# EAGLE design VIO module (EAGLE 5.07)
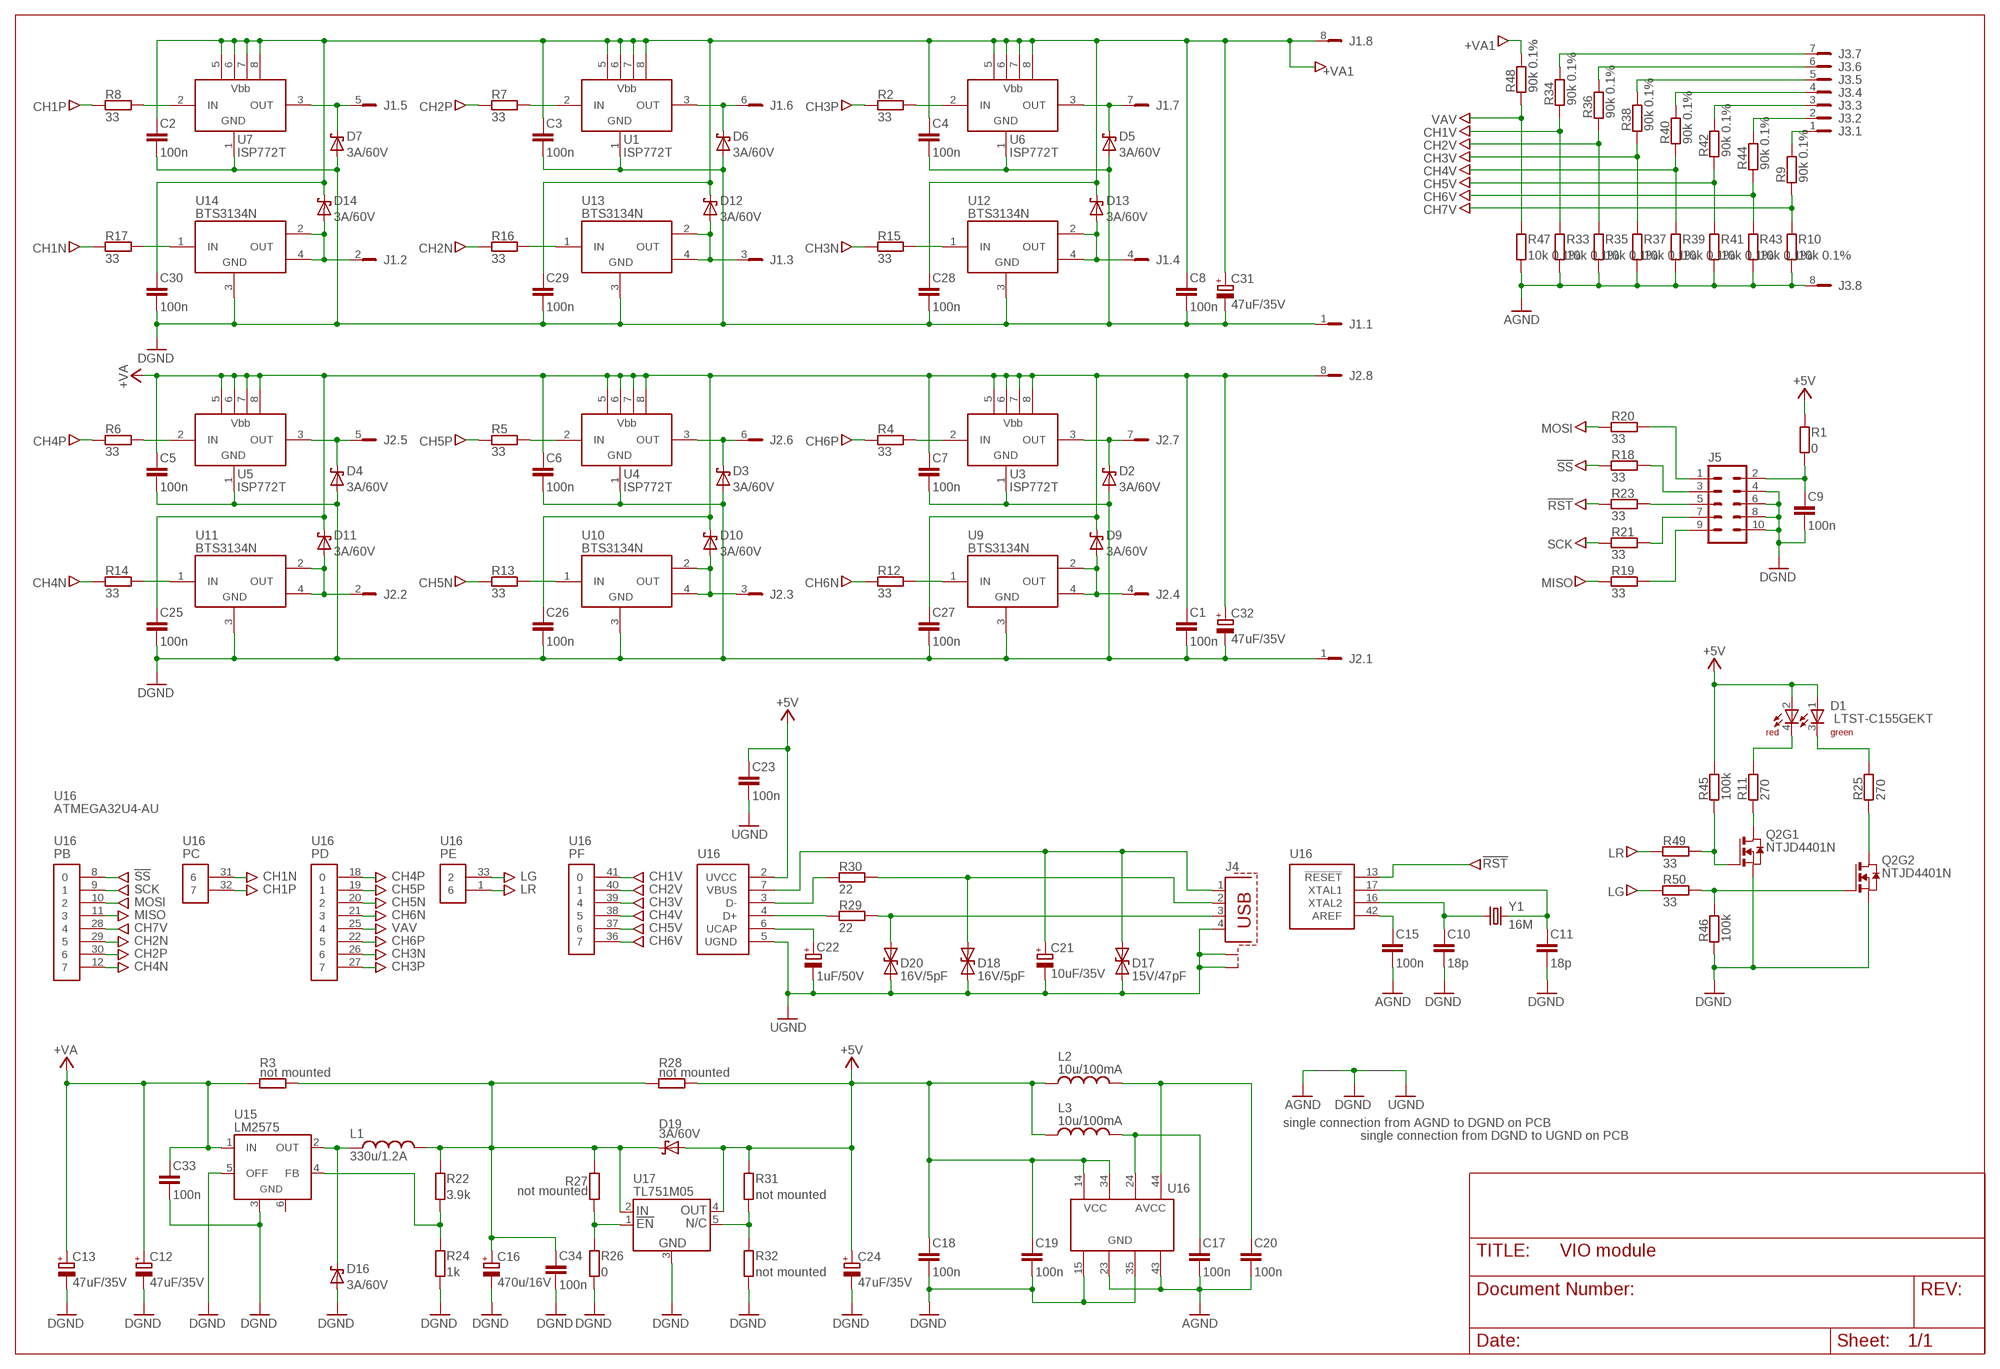
[diagram p0: schematic, sheet 1]

## Parts
C1  100n  C-X7R-0805  [C0805K]
C2  100n  C-X7R-0805  [C0805K]
C3  100n  C-X7R-0805  [C0805K]
C4  100n  C-X7R-0805  [C0805K]
C5  100n  C-X7R-0805  [C0805K]
C6  100n  C-X7R-0805  [C0805K]
C7  100n  C-X7R-0805  [C0805K]
C8  100n  C-X7R-0805  [C0805K]
C9  100n  C-X7R-0805  [C0805K]
C10  18p  C-C0G-0603  [C0603K]
C11  18p  C-C0G-0603  [C0603K]
C12  47uF/35V  CP-ALU-D  [PANASONIC_D]
C13  47uF/35V  CP-ALU-D  [PANASONIC_D]
C15  100n  C-X7R-0805  [C0805K]
C16  470u/16V  CP-ALU-F  [PANASONIC_F]
C17  100n  C-X7R-0805  [C0805K]
C18  100n  C-X7R-0805  [C0805K]
C19  100n  C-X7R-0805  [C0805K]
C20  100n  C-X7R-0805  [C0805K]
C21  10uF/35V  CP-ALU-B  [PANASONIC_B]
C22  1uF/50V  CP-ALU-B  [PANASONIC_B]
C23  100n  C-X7R-0805  [C0805K]
C24  47uF/35V  CP-ALU-D  [PANASONIC_D]
C25  100n  C-X7R-0805  [C0805K]
C26  100n  C-X7R-0805  [C0805K]
C27  100n  C-X7R-0805  [C0805K]
C28  100n  C-X7R-0805  [C0805K]
C29  100n  C-X7R-0805  [C0805K]
C30  100n  C-X7R-0805  [C0805K]
C31  47uF/35V  CP-ALU-D  [PANASONIC_D]
C32  47uF/35V  CP-ALU-D  [PANASONIC_D]
C33  100n  C-X7R-0805  [C0805K]
C34  100n  C-X7R-0805  [C0805K]
D1  LTST-C155GEKT  D-2LED4-320X270  [D-LITEON-LTST]
D2  3A/60V  DS-B360A-SMA  [SMA]
D3  3A/60V  DS-B360A-SMA  [SMA]
D4  3A/60V  DS-B360A-SMA  [SMA]
D5  3A/60V  DS-B360A-SMA  [SMA]
D6  3A/60V  DS-B360A-SMA  [SMA]
D7  3A/60V  DS-B360A-SMA  [SMA]
D9  3A/60V  DS-B360A-SMA  [SMA]
D10  3A/60V  DS-B360A-SMA  [SMA]
D11  3A/60V  DS-B360A-SMA  [SMA]
D12  3A/60V  DS-B360A-SMA  [SMA]
D13  3A/60V  DS-B360A-SMA  [SMA]
D14  3A/60V  DS-B360A-SMA  [SMA]
D16  3A/60V  DS-B360A-SMA  [SMA]
D17  15V/47pF  CDS2C15GTA  [EPCOS_CD_0402]
D18  16V/5pF  CDS2C16GTH  [EPCOS_CD_0402]
D19  3A/60V  DS-B360A-SMA  [SMA]
D20  16V/5pF  CDS2C16GTH  [EPCOS_CD_0402]
J1  J-M8-TB508V  J-M8-TB508HV  [J-M8-TB508HV]
J2  J-M8-TB508V  J-M8-TB508HV  [J-M8-TB508HV]
J3  J-M8-TB508V  J-M8-TB508HV  [J-M8-TB508HV]
J4  J-USB6-BV  [J-USB6-BV]
J5  J-M10-V  [J-M10-V]
L1  330u/1.2A  L-TOROIDAL-MURATA3300  [MURATA3300]
L2  10u/100mA  L-CHIP-1210  [R1210]
L3  10u/100mA  L-CHIP-1210  [R1210]
Q2  NTJD4401N  Q-2ND-SOT363  [SOT363]
R1  0  R-0603  [R0603]
R2  33  R-0603  [R0603]
R3  not mounted  R-0603  [R0603]
R4  33  R-0603  [R0603]
R5  33  R-0603  [R0603]
R6  33  R-0603  [R0603]
R7  33  R-0603  [R0603]
R8  33  R-0603  [R0603]
R9  90k 0.1%  R-0603  [R0603]
R10  10k 0.1%  R-0603  [R0603]
R11  270  R-0603  [R0603]
R12  33  R-0603  [R0603]
R13  33  R-0603  [R0603]
R14  33  R-0603  [R0603]
R15  33  R-0603  [R0603]
R16  33  R-0603  [R0603]
R17  33  R-0603  [R0603]
R18  33  R-0603  [R0603]
R19  33  R-0603  [R0603]
R20  33  R-0603  [R0603]
R21  33  R-0603  [R0603]
R22  3.9k  R-0603  [R0603]
R23  33  R-0603  [R0603]
R24  1k  R-0603  [R0603]
R25  270  R-0603  [R0603]
R26  0  R-0603  [R0603]
R27  not mounted  R-0603  [R0603]
R28  not mounted  R-0603  [R0603]
R29  22  R-0402  [0402]
R30  22  R-0402  [0402]
R31  not mounted  R-0603  [R0603]
R32  not mounted  R-0603  [R0603]
R33  10k 0.1%  R-0603  [R0603]
R34  90k 0.1%  R-0603  [R0603]
R35  10k 0.1%  R-0603  [R0603]
R36  90k 0.1%  R-0603  [R0603]
R37  10k 0.1%  R-0603  [R0603]
R38  90k 0.1%  R-0603  [R0603]
R39  10k 0.1%  R-0603  [R0603]
R40  90k 0.1%  R-0603  [R0603]
R41  10k 0.1%  R-0603  [R0603]
R42  90k 0.1%  R-0603  [R0603]
R43  10k 0.1%  R-0603  [R0603]
R44  90k 0.1%  R-0603  [R0603]
R45  100k  R-0603  [R0603]
R46  100k  R-0603  [R0603]
R47  10k 0.1%  R-0603  [R0603]
R48  90k 0.1%  R-0603  [R0603]
R49  33  R-0603  [R0603]
R50  33  R-0603  [R0603]
U1  ISP772T  [SO08]
U3  ISP772T  [SO08]
U4  ISP772T  [SO08]
U5  ISP772T  [SO08]
U6  ISP772T  [SO08]
U7  ISP772T  [SO08]
U9  BTS3134N  [SOT223-R]
U10  BTS3134N  [SOT223-R]
U11  BTS3134N  [SOT223-R]
U12  BTS3134N  [SOT223-R]
U13  BTS3134N  [SOT223-R]
U14  BTS3134N  [SOT223-R]
U15  LM2575  LM2575-TO263  [TO263-5]
U16  ATMEGA32U4-AU  [TQFP44]
U17  TL751M05  U-VPDN-TO263  [TO263-5]
Y1  16M  X-HC49UP  [HC49UP]

## Nets
!RST: R23.2 U16.13(SYS:!RESET)
!SS: R18.2 U16.8
+5V: C18.1 C19.1 C23.1 C24.+ D1.1(GA) D1.2(RA) D19.A L2.1 L3.1 R1.2 R28.1 R31.2 R45.1 U16.2(USB:UVCC) U16.14(PWR:VCC1) U16.34(PWR:VCC2) U17.4(OUT)
+5VA1: C20.1 L2.2 U16.44(PWR:AVCC2)
+VA: C1.1 C5.1 C6.1 C7.1 C12.+ C13.+ C25.1 C26.1 C27.1 C32.+ C33.1 D9.K(C) D10.K(C) D11.K(C) J2.8 R3.2 U3.5(VBB1) U3.6(VBB2) U3.7(VBB3) U3.8(VBB4) U4.5(VBB1) U4.6(VBB2) U4.7(VBB3) U4.8(VBB4) U5.5(VBB1) U5.6(VBB2) U5.7(VBB3) U5.8(VBB4) U15.1(IN)
+VA1: C2.1 C3.1 C4.1 C8.1 C28.1 C29.1 C30.1 C31.+ D12.K(C) D13.K(C) D14.K(C) J1.8 R48.1 U1.5(VBB1) U1.6(VBB2) U1.7(VBB3) U1.8(VBB4) U6.5(VBB1) U6.6(VBB2) U6.7(VBB3) U6.8(VBB4) U7.5(VBB1) U7.6(VBB2) U7.7(VBB3) U7.8(VBB4)
AGND: C15.2 C17.2 C20.2 J3.8 R10.1 R33.1 R35.1 R37.1 R39.1 R41.1 R43.1 R47.1 U16.23(PWR:GND2) U16.43(PWR:GND4)
CH1N: R17.2 U16.31
CH1P: R8.2 U16.32
CH1V: R33.2 R34.2 U16.41
CH2N: R16.2 U16.29
CH2P: R7.2 U16.30
CH2V: R35.2 R36.2 U16.40
CH3N: R15.2 U16.26
CH3P: R2.2 U16.27
CH3V: R37.2 R38.2 U16.39
CH4N: R14.2 U16.12
CH4P: R6.2 U16.18
CH4V: R39.2 R40.2 U16.38
CH5N: R13.2 U16.20
CH5P: R5.2 U16.19
CH5V: R41.2 R42.2 U16.37
CH6N: R12.2 U16.21
CH6P: R4.2 U16.22
CH6V: R43.2 R44.2 U16.36
CH7V: R9.2 R10.2 U16.28
DGND: C1.2 C2.2 C3.2 C4.2 C5.2 C6.2 C7.2 C8.2 C9.2 C10.2 C11.2 C12.- C13.- C16.- C18.2 C19.2 C24.- C25.2 C26.2 C27.2 C28.2 C29.2 C30.2 C31.- C32.- C33.2 C34.2 D2.A D3.A D4.A D5.A D6.A D7.A D16.A J1.1 J2.1 J5.4 J5.6 J5.8 J5.10 Q2.1(S) Q2.4(S) R24.1 R26.1 R32.1 R46.2 U1.1(GND) U3.1(GND) U4.1(GND) U5.1(GND) U6.1(GND) U7.1(GND) U9.3(GND) U10.3(GND) U11.3(GND) U12.3(GND) U13.3(GND) U14.3(GND) U15.3(GND) U15.5(OFF) U16.15(PWR:GND1) U16.35(PWR:GND3) U17.3(GND)
IO1N: D14.A J1.2 U14.2(OUT) U14.4(OUT)
IO1P: D7.K(C) J1.5 U7.3(OUT)
IO2N: D12.A J1.3 U13.2(OUT) U13.4(OUT)
IO2P: D6.K(C) J1.6 U1.3(OUT)
IO3N: D13.A J1.4 U12.2(OUT) U12.4(OUT)
IO3P: D5.K(C) J1.7 U6.3(OUT)
IO4N: D11.A J2.2 U11.2(OUT) U11.4(OUT)
IO4P: D4.K(C) J2.5 U5.3(OUT)
IO5N: D10.A J2.3 U10.2(OUT) U10.4(OUT)
IO5P: D3.K(C) J2.6 U4.3(OUT)
IO5V: J3.3 R42.1
IO6N: D9.A J2.4 U9.2(OUT) U9.4(OUT)
IO6P: D2.K(C) J2.7 U3.3(OUT)
IO6V: J3.2 R44.1
LG: R50.2 U16.33
LR: R49.2 U16.1
MISO: R19.2 U16.11
MOSI: R20.2 U16.10
N$1: C22.+ U16.6(USB:UCAP)
N$2: C10.1 U16.16(SYS:XTAL2) Y1.1
N$3: R7.1 U1.2(IN)
N$4: R16.1 U13.1(IN)
N$5: R17.1 U14.1(IN)
N$6: R8.1 U7.2(IN)
N$7: R29.1 U16.4(USB:D+)
N$8: C21.+ D17.2 J4.1 U16.7(USB:VBUS)
N$9: C16.+ C34.1 D19.K(C) L1.3 R3.1 R22.2 R27.2 R28.2 U17.2(IN)
N$10: D20.2 J4.3 R29.2
N$11: R30.1 U16.3(USB:D-)
N$12: C15.1 U16.42(SYS:AREF)
N$13: D18.2 J4.2 R30.2
N$14: C11.1 U16.17(SYS:XTAL1) Y1.2
N$15: J5.3 R18.1
N$16: J5.9 R19.1
N$17: J5.5 R23.1
N$18: R22.1 R24.2 U15.4(FB)
N$19: J5.7 R21.1
N$20: J5.1 R20.1
N$21: C9.1 J5.2 R1.1
N$22: D16.K(C) L1.1 U15.2(OUT)
N$23: R31.1 R32.2 U17.5(N/C)
N$24: R26.2 R27.1 U17.1(!EN)
N$25: R2.1 U6.2(IN)
N$26: R15.1 U12.1(IN)
N$27: R6.1 U5.2(IN)
N$28: R14.1 U11.1(IN)
N$29: R5.1 U4.2(IN)
N$30: R13.1 U10.1(IN)
N$31: R4.1 U3.2(IN)
N$32: R12.1 U9.1(IN)
N$33: C17.1 L3.2 U16.24(PWR:AVCC1)
N$34: J3.1 R9.1
N$37: D1.3(GC) R25.1
N$38: Q2.6(D) R11.2
N$39: Q2.3(D) R25.2
N$40: D1.4(RC) R11.1
N$41: Q2.2(G) R45.2 R49.1
N$43: Q2.5(G) R46.1 R50.1
N$47: J3.4 R40.1
N$48: J3.5 R38.1
N$49: J3.6 R36.1
N$50: J3.7 R34.1
SCK: R21.2 U16.9
UGND: C21.- C22.- C23.2 D17.1 D18.1 D20.1 J4.4 J4.S1 J4.S2 U16.5(USB:UGND) ; supply symbol labelled SGNDU
VAV: R47.2 R48.2 U16.25
Unconnected: U15.6(GND)

## Notes on the sheet
- single connection from AGND to DGND on PCB
- single connection from DGND to UGND on PCB

## Library data of the parts
C1-C11 C15 C17-C20 C23 C25-C30 C33 C34 = VIO_module:C-*-?: CAPACITOR, European symbol
C12 C13 C16 C21 C22 C24 C31 C32 = VIO_module:CP-*-?: Aluminium electrolytic capacitor
D1 = VIO_module:D-2LED4-?: Duo LED, 4 poles, red and green
D2-D7 D9-D14 D16 D19 = VIO_module:DS-*-?: schottky diode
D17 D18 D20 = VIO_module:CD: bidirectional zener diode Standard series Device VDC,max V Ctyp pF CDS2C15GTA 15 47 High speed series Device VDC,max V Ctyp pF CDS2C16GTH 16 5
J1-J3 = VIO_module:J-M8-?: Jack connector, male, 8 poles
J4 = VIO_module:J-USB6-?: USB connector
J5 = VIO_module:J-M10-?: HARTING
L1-L3 = VIO_module:L-*-?: Inductor
Q2 = VIO_module:Q-2ND-?: MOS FET
R1-R50 = VIO_module:R-?: Resistor
U1 U3-U7 = VIO_module:ISP*?: Smart power high-side-switch for industrial applications
U9-U14 = VIO_module:BTS*?: Smart low side power switch
U15 = VIO_module:LM25*-?: STEP-DOWN VOLTAGE REGULATOR
U16 = VIO_module:ATMEGA*U4?
U17 = VIO_module:U-VPDN-?: Linear fixed voltage regulator with enable
Y1 = VIO_module:X-?: CRYSTAL

## Board
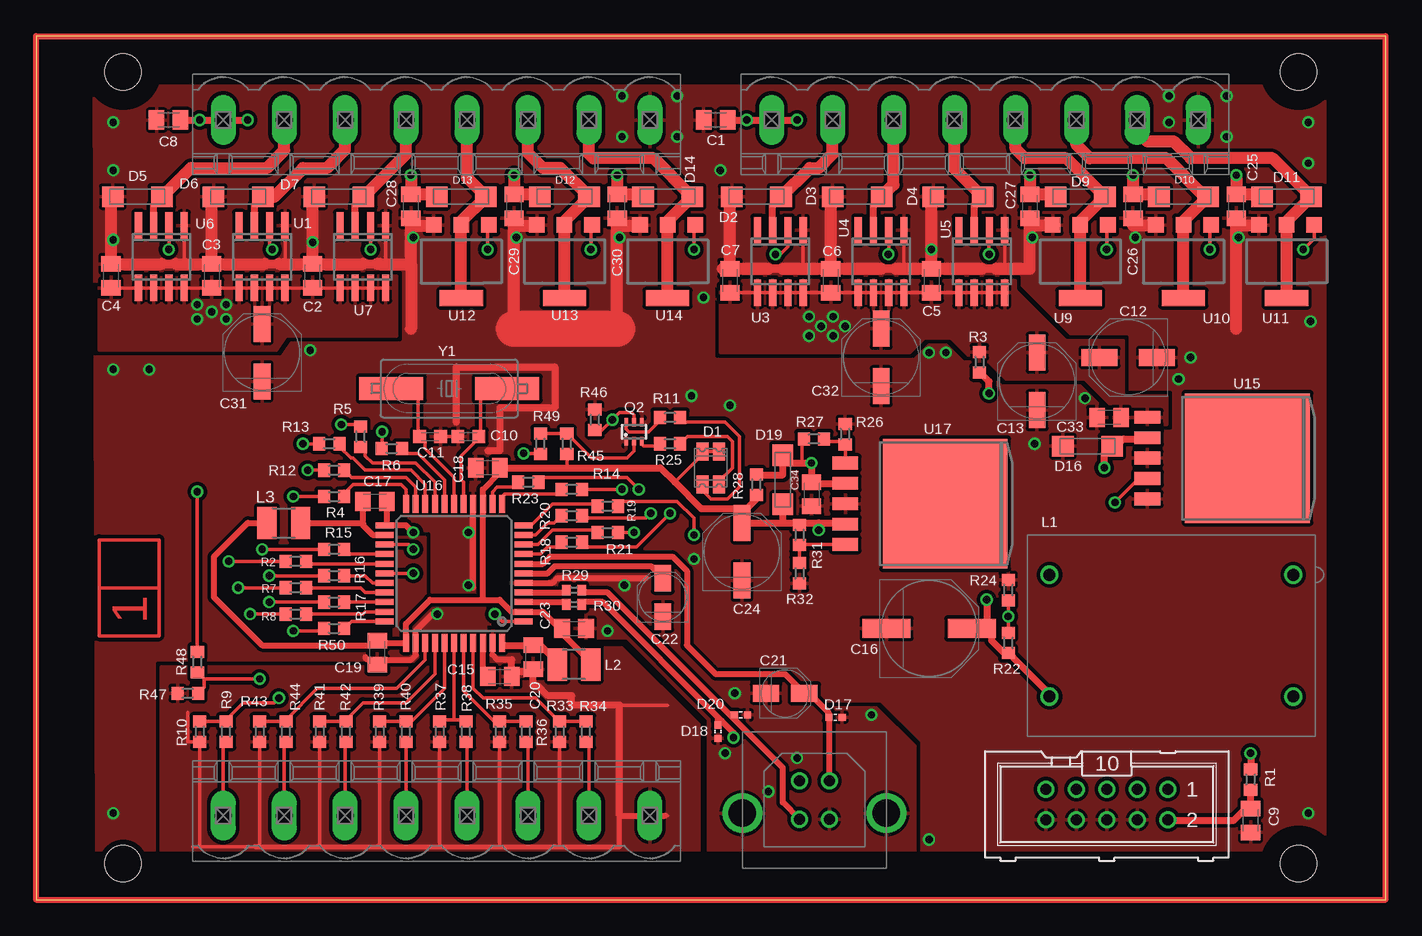
[diagram p1: board, top side]
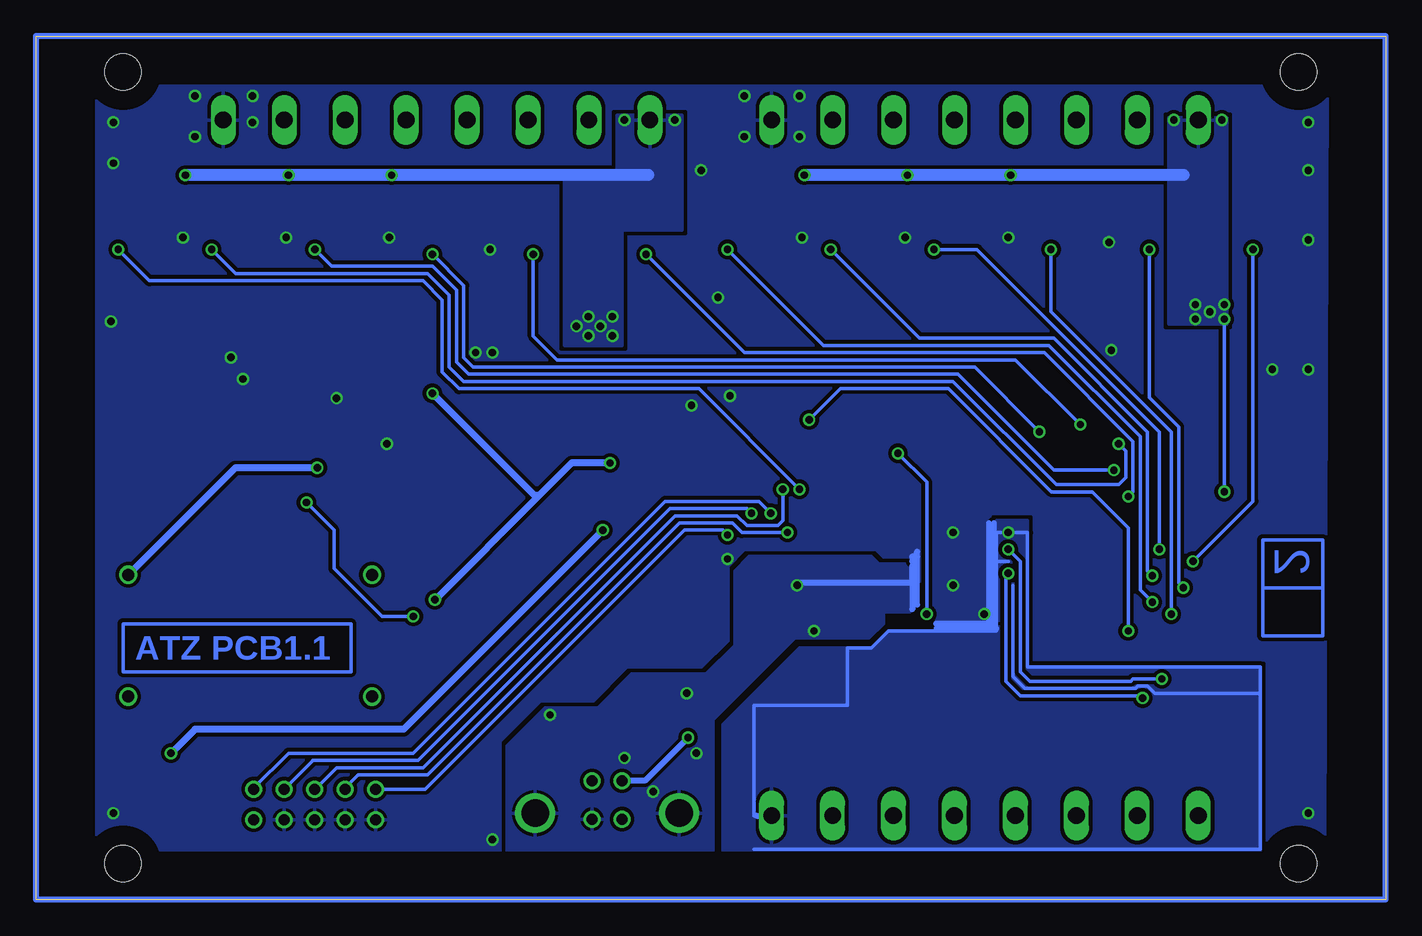
[diagram p2: board, bottom side, seen from below]

Size 112.5 x 72 mm. Coordinates in mm from the lower left corner, seen from the top.
Outline: 0,0 112.5,0 112.5,72 0,72 0,0
Copper layers (1*16): Top 0.035mm / dielectric 1.5mm / Bottom 0.035mm
Design rules "VIO module *": minimum track width 8mil, minimum drill 0.6mm, track to track 0.3mm, track to pad 0.3mm, pad to pad 0.3mm, via to via 0.3mm, smd to smd 0.3mm, copper to edge 0.5mm, drill to drill 8mil, minimum pad ring 10mil, minimum via ring 8mil, stop-mask expansion 0mil, vias tented up to drill 0mil, thermal gap 10mil
Holes 3 mm at 7.25,69 105.25,69 105.25,3 7.25,3
tRestrict: area 4.2,68 to 108.2,71.5; area 4.2,0.5 to 108.2,4; area 4.2,66 to 10.2,72; area 102.2,66 to 108.2,72; area 102.2,0 to 108.2,6
bRestrict: area 4.2,68 to 108.2,71.5; area 4.2,0.5 to 108.2,4; area 4.2,66 to 10.2,72; area 102.2,66 to 108.2,72; area 102.2,0 to 108.2,6; area 4.2,0 to 10.2,6

### Footprints (pad centres in the part's own frame; a part is rotated, then mirrored left to right if it is on the bottom)
C0805K = smd 1.3 x 1.6: 1 -1,0; 2 1,0
C0603K = smd 1.05 x 1.08: 1 -0.875,0; 2 0.875,0
PANASONIC_D = smd 3 x 1.4: + 2.4,0; - -2.4,0
PANASONIC_F = smd 4 x 1.6: + 3.55,0; - -3.55,0
PANASONIC_B = smd 2.2 x 1.4: + 1.6,0; - -1.6,0
D-LITEON-LTST = smd 1 x 1.5: 1 0.7,1.375; 2 -0.7,1.375; 3 0.7,-1.375; 4 -0.7,-1.375
SMA = smd 1.8 x 1.7: A -2.05,0; K 2.05,0
EPCOS_CD_0402 = smd 0.6 x 0.6: 1 -0.55,0; 2 0.55,0
J-M8-TB508HV = drill 1.4 long: 1 0,0; 2 5.08,0; 3 10.16,0; 4 15.24,0; 5 20.32,0; 6 25.4,0; 7 30.48,0; 8 35.56,0
J-USB6-BV = drill 0.92 round: 1 1.25,1.6; 2 -1.25,1.6; 3 -1.25,-1.6; 4 1.25,-1.6 | drill 2.3 round: S1 6,-1.1; S2 -6,-1.1
J-M10-V = drill 0.91 round: 1 0,0; 2 0,2.54; 3 2.54,0; 4 2.54,2.54; 5 5.08,0; 6 5.08,2.54; 7 7.62,0; 8 7.62,2.54; 9 10.16,0; 10 10.16,2.54
MURATA3300 = drill 1 round: 1 -10.16,-5.08; 2 10.16,-5.08; 3 10.16,5.08; 4 -10.16,5.08
R1210 = smd 1.6 x 2.7: 1 -1.4,0; 2 1.4,0
SOT363 = smd 0.3 x 0.7: 1 -0.65,-0.8; 2 0,-0.8; 3 0.65,-0.8; 4 0.65,0.8; 5 0,0.8; 6 -0.65,0.8
R0603 = smd 1 x 1.1: 1 -0.85,0; 2 0.85,0
0402 = smd 0.7 x 0.9: 1 -0.65,0; 2 0.65,0
SO08 = smd 0.6 x 2.2: 1 -1.905,-2.6; 2 -0.635,-2.6; 3 0.635,-2.6; 4 1.905,-2.6; 5 1.905,2.6; 6 0.635,2.6; 7 -0.635,2.6; 8 -1.905,2.6
SOT223-R = smd 1.3 x 1.3: 1 -2.3,-3.05; 2 0,-3.05; 3 2.3,-3.05 | smd 3.6 x 1.3: 4 0,3.05
TO263-5 = smd 1.067 x 2.159: 1 -3.404,-5.791; 2 -1.702,-5.791; 3 0,-5.791; 4 1.702,-5.791; 5 3.404,-5.791 | smd 10.8 x 10.41: 6 0,2.54
TQFP44 = smd 1.5 x 0.5: 1 -5.8,4; 2 -5.8,3.2; 3 -5.8,2.4; 4 -5.8,1.6; 5 -5.8,0.8; 6 -5.8,0; 7 -5.8,-0.8; 8 -5.8,-1.6; 9 -5.8,-2.4; 10 -5.8,-3.2; 11 -5.8,-4; 23 5.8,-4; 24 5.8,-3.2; 25 5.8,-2.4; 26 5.8,-1.6; 27 5.8,-0.8; 28 5.8,0; 29 5.8,0.8; 30 5.8,1.6; 31 5.8,2.4; 32 5.8,3.2; 33 5.8,4 | smd 0.5 x 1.5: 12 -4,-5.8; 13 -3.2,-5.8; 14 -2.4,-5.8; 15 -1.6,-5.8; 16 -0.8,-5.8; 17 0,-5.8; 18 0.8,-5.8; 19 1.6,-5.8; 20 2.4,-5.8; 21 3.2,-5.8; 22 4,-5.8; 34 4,5.8; 35 3.2,5.8; 36 2.4,5.8; 37 1.6,5.8; 38 0.8,5.8; 39 0,5.8; 40 -0.8,5.8; 41 -1.6,5.8; 42 -2.4,5.8; 43 -3.2,5.8; 44 -4,5.8
HC49UP = smd 5.334 x 1.93: 1 -4.826,0; 2 4.826,0

### Placement (x,y rotation side)
C1  56.65,65 180 top
C2  23.05,52 90 top
C3  14.65,52 90 top
C4  6.25,52 90 top
C5  74.65,51.6 90 top
C6  66.25,51.6 90 top
C7  57.85,51.6 90 top
C8  11.05,65 180 top
C9  101.25,6.6 270 top
C10  36.05,38.6 180 top
C11  32.85,38.6 0 top
C12  91.05,45.2 180 top
C13  83.45,43.2 90 top
C15  38.65,18.6 0 top
C16  74.45,22.6 0 top
C17  28.25,33.2 0 top
C18  37.65,36 180 top
C19  28.45,20.6 270 top
C20  41.45,20.2 270 top
C21  62.45,17.2 0 top
C22  52.25,25.2 90 top
C23  44.85,22.6 0 top
C24  58.85,29 90 top
C25  100.05,57.8 270 top
C26  91.45,57.8 270 top
C27  82.85,57.8 270 top
C28  31.25,57.8 270 top
C29  39.85,57.8 270 top
C30  48.45,57.8 270 top
C31  18.85,45.6 90 top
C32  70.45,45.2 90 top
C33  89.45,40.2 180 top
C34  64.65,33.8 270 top
D1  56.25,36 0 top
D2  60.05,58.6 0 top
D3  68.45,58.6 0 top
D4  76.85,58.6 0 top
D5  8.45,58.6 0 top
D6  16.85,58.6 0 top
D7  25.25,58.6 0 top
D9  87.05,58.6 180 top
D10  95.65,58.6 180 top
D11  104.25,58.6 180 top
D12  44.05,58.6 180 top
D13  35.45,58.6 180 top
D14  52.65,58.6 180 top
D16  87.65,37.8 0 top
D17  66.65,15.2 180 top
D18  56.85,14 90 top
D19  62.25,35 90 top
D20  58.75,15.4 180 top
J1  51.17,65 180 top
J2  96.89,65 180 top
J3  15.61,7 0 top
J4  64.89,8.3 0 top
J5  94.35,9.2 180 top
L1  94.65,22 180 top
L2  44.85,19.6 180 top
L3  20.65,31.4 0 top
Q2  49.85,39 0 top
R1  101.25,10 90 top
R2  21.65,28.2 0 top
R3  78.65,44.8 90 top
R4  24.85,33.6 0 top
R5  27.05,38.6 270 top
R6  29.65,37.6 0 top
R7  21.65,26 0 top
R8  21.65,23.8 0 top
R9  15.85,14 90 top
R10  13.65,14 90 top
R11  52.85,40.2 180 top
R12  24.85,35.8 0 top
R13  24.45,38 0 top
R14  44.65,34.2 180 top
R15  24.85,29.2 0 top
R16  24.85,27 0 top
R17  24.85,24.8 0 top
R18  44.65,29.8 180 top
R19  47.65,32.8 180 top
R20  44.65,32 180 top
R21  47.65,30.6 180 top
R22  81.05,21.4 270 top
R23  41.05,34.8 180 top
R24  81.05,25.8 270 top
R25  52.85,38 180 top
R26  67.45,38.8 270 top
R27  64.85,38.4 180 top
R28  60.05,34.6 90 top
R29  44.85,25.8 0 top
R30  44.85,24.6 0 top
R31  63.65,30.4 90 top
R32  63.65,27.2 90 top
R33  43.65,14 90 top
R34  45.85,14 90 top
R35  38.65,14 90 top
R36  40.85,14 90 top
R37  33.65,14 90 top
R38  35.85,14 90 top
R39  28.65,14 90 top
R40  30.85,14 90 top
R41  23.65,14 90 top
R42  25.85,14 90 top
R43  18.65,14 90 top
R44  20.85,14 90 top
R45  44.25,38 90 top
R46  46.59,40 90 top
R47  12.65,17.2 0 top
R48  13.45,19.8 270 top
R49  42.05,38 270 top
R50  24.85,22.6 0 top
U1  18.85,53.6 180 top
U3  62.05,53.2 180 top
U4  70.45,53.2 180 top
U5  78.85,53.2 180 top
U6  10.45,53.6 180 top
U7  27.25,53.6 180 top
U9  87.05,53.2 180 top
U10  95.65,53.2 180 top
U11  104.25,53.2 180 top
U12  35.45,53.2 180 top
U13  44.05,53.2 180 top
U14  52.65,53.2 180 top
U15  98.45,36.8 270 top
U16  34.85,27.2 180 top
U17  73.25,33 270 top
Y1  34.45,42.6 180 top

### Tracks (layer width: path | path; a pad name or v marks a point on that pad's centre or on a via)
!RST
  Top 0.3: U16.13 38.05,34 38.45,34.4 39.8,34.4 R23.2
!SS
  Top 0.3: U16.8 42.05,28.8 42.65,29.4 43.4,29.4 R18.2
+5V  (via drill 0.6)
  Top 0.3: 57.05,37.48 D1.1 D1.2 55.25,37.08 55.25,36.8 53.25,34.8 | 44.25,36 R45.1 | R31.2 63.8,31.4 64.05,31.4 | 28.85,21.4 28.65,21.6 C19.1
  Top 0.5: 28.65,21.4 28.85,21.4 | C19.1 28.65,21.4 | C18.1 38.65,35.6 37.25,34.2 U16.14 37.25,25 | 37.25,25 32.85,25 30.85,23 U16.34 29.05,21.4 28.85,21.6 C19.1 | 37.25,25 38.65,25 39.65,24 U16.2 42.25,24 43.65,22.6 C23.1 44.05,22.4 44.05,22 45.85,20.2 46.25,20.2 L2.1 | 28.65,21.4 28.45,21.2 | L3.1 17.65,31.4 14.85,28.6 14.85,25.2 18.85,21.2 27.85,21.2 28.25,21.6 C19.1
  Top 0.6: L2.1 46.25,19.8 | C18.1 44.25,36 52.05,36 53.25,34.8 55.45,32.6 58.45,32.6 58.85,32.2 | 58.85,32.2 C24.+ 62.25,31.4 | v101.25,12.2 R1.2 | U17.4 67.36,31.4 65.25,31.4 | 62.25,31.4 64.05,31.4 65.25,31.4 | 58.85,32.2 60.05,33.4 R28.1 | 62.25,31.4 D19.A | 65.25,31.4 v65.25,30.8
  Bottom 0.6: v101.25,12.2 99.25,14.2 81.85,14.2 v65.25,30.8
+5VA1
  Top 0.5: 39.05,21.2 U16.44
  Top 0.6: L2.2 43.45,19.8 42.05,21.2 C20.1 39.05,21.2
+VA  (via drill 0.6)
  Top 0.3: U5.8 U5.7 U5.6 U5.5 75.25,50.6 75.25,51 | C5.1 U4.8 U4.7 U4.6 U4.5 66.85,50.6 66.85,51 | C6.1 U3.8 U3.7 U3.6 U3.5 58.45,50.6 58.45,51
  Top 0.6: C1.1 v59.25,65 v63.45,65
  Top 1: D9.K 84.8,58.8 C27.1 v82.85,60.4 | D10.K 93.4,58.8 C26.1 v91.45,60.4 | D11.K 102,58.8 C25.1 v100.05,60.4
  Bottom 1: 61.45,60.4 v82.85,60.4 v91.45,60.4 v100.05,60.4
  other vias: 64.45,48.6 64.45,47 65.45,47.8 66.45,47 66.45,48.6 67.45,47.8
  pour Top: 57.05,51.6 81.65,51.6 81.65,50.8 85.85,46.6 90.65,46.6 90.65,42 94.25,42 94.25,39.6 89.85,39.6 89.85,41 87.45,43.4 80.85,43.4 79.45,44.8 78.25,44.8 76.25,46.8 74.05,46.8 72.85,45.6 57.05,45.6
  pour Bottom: 58.65,65.4 64.05,65.4 64.05,60.6 68.45,60.6 68.45,46.2 63.65,46.2 63.65,55.8 58.65,55.8
+VA1  (via drill 0.6)
  Top 0.3: U7.8 U7.7 U7.6 U7.5 C2.1 U1.8 U1.7 U1.6 U1.5 C3.1 U6.8 U6.7 U6.6 U6.5 C4.1 | R48.1 v13.45,34
  Top 0.6: C8.1 v13.65,65 v17.65,65
  Top 1: D13.K 33.2,58.8 C28.1 v31.25,60.4 | D12.K 41.8,58.8 C29.1 v39.85,60.4 | D14.K 50.4,58.8 C30.1 v48.45,60.4
  Bottom 0.3: v13.45,34 v13.45,48.4
  Bottom 1: 16.85,60.4 v31.25,60.4 v39.85,60.4 v48.45,60.4
  other vias: 13.45,49.6 15.85,49.6 15.85,48.4 14.65,49
  pour Bottom: 13.25,65.2 18.05,65.2 18.05,48 13.25,48
  pour Top: 5.25,52 30.05,52 30.05,47 20.85,47 20.05,45.8 5.25,45.8
AGND  (via drill 0.6)
  Top 0.3: 13.65,4.4 18.25,4.4 | 44.65,16.2 44.85,16.2 | 48.65,16.2 52.65,16.2 | 33.65,4.4 R37.1 | 38.65,4.4 R35.1 | R33.1 43.65,4.4 43.25,4.4 | R39.1 28.65,4.4 28.45,4.4 | R41.1 23.65,4.4 23.45,4.4 | R43.1 18.65,4.4 18.45,4.4 | 13.65,4.4 R10.1 12.65,13.15 12.65,15.6 | 13.05,4.4 13.65,4.4 | 52.45,7 52.65,7
  Top 0.4: 18.25,4.4 18.45,4.4 23.45,4.4 28.45,4.4 33.65,4.4 38.65,4.4 43.25,4.4 48.65,4.4 48.65,7
  Top 0.5: 38.05,20.4 38.45,20 39.65,20 | C15.2 39.45,18.8 | 48.65,7 52.45,7 | 41.45,19 C20.2 | 29.25,31.2 U16.23 | 29.25,31.2 C17.2 29.25,33.4 | v31.45,30.6 30.85,31.2 29.25,31.2
  Top 0.6: 48.65,7 48.65,16.2 44.65,16.2 44.65,17 42.65,17 41.85,17.8 41.45,17.8 41.45,19 39.65,19 | 39.65,19 39.65,20 | 39.65,19 C15.2 | C20.2 41.05,19.2
  Bottom 0.3: 32.45,28.2 32.45,30.6 v31.45,30.6 29.85,30.6 29.85,19.4 10.45,19.4 10.45,17.2 | 32.45,28.2 32.45,22.6 32.45,22.4 41.45,22.4 42.85,21 44.85,21 44.85,16.2 52.65,16.2 52.65,7 52.45,7 | 10.45,17.2 19.25,17.2 19.85,17.8 20.65,17.8 20.85,17.6 30.05,17.6 31.05,18.6 31.05,26.2 | 10.45,17.2 10.45,4.2 52.65,4.2 | 32.45,28.2 31.45,28.2
  Bottom 0.45: 32.65,23 32.65,31.4 | 32.45,22.6 37.45,22.6
  Bottom 0.5: 52.45,7 J3.8 | 32.45,22.6 32.65,22.6 32.65,23
  pour Bottom: 10.45,19.4 29.85,19.4 29.85,31.6 32.45,31.6 32.45,22.4 41.45,22.4 42.85,21 48.85,21 55.25,14.6 55.25,0 10.45,0
  pour Top: 10.45,19.4 29.85,19.4 29.85,30.2 32.45,30.2 32.45,22.4 41.45,22.4 42.85,21 48.85,21 55.25,14.6 55.25,0 10.45,0
CH1N
  Top 0.3: R17.2 U16.31
CH1P
  Top 0.3: U16.32 27.45,24 27.25,23.8 R8.2
CH1V
  Top 0.3: R34.2 R33.2 43.6,14.85 41.65,16.8 37.25,16.8 36.45,17.6 U16.41
CH2N
  Top 0.3: U16.29 28.05,26.4 27.45,27 R16.2
CH2P
  Top 0.3: U16.30 27.45,25.6 27.05,26 22.65,26 R7.2 22.45,26
CH2V
  Top 0.3: R35.2 R36.2 | U16.40 35.65,17.4 38.2,14.85 R35.2 | 38.25,15 38.65,15 R35.2
CH3N
  Top 0.3: U16.26 26.1,28.8 R15.2
CH3P
  Top 0.3: U16.27 22.65,28 22.5,28.15 R2.2
CH3V
  Top 0.3: 33.6,14.85 R37.2 33.65,14.8 33.85,15 34.85,15 | 34.85,15 U16.39 | 34.85,15 35.45,15 35.6,14.85 R38.2
CH4N
  Top 0.3: U16.12 38.85,33.6 39.05,33.8 43.45,33.8 43.45,34.2 R14.2
CH4P
  Top 0.3: U16.18 34.05,35 31.85,37.2 30.9,37.2 R6.2
CH4V
  Top 0.3: R39.2 R40.2 31.3,14.85 34.05,17.6 U16.38
CH5N
  Top 0.3: U16.20 32.45,34.6 31.25,35.8 27.45,35.8 26.45,36.8 26.25,36.8 25.3,37.75 R13.2
CH5P
  Top 0.3: U16.19 33.25,34.8 31.65,36.4 28.05,36.4 27.45,37 27.45,37.35 R5.2
CH5V
  Top 0.3: R41.2 R42.2 25.85,15 27.25,16.4 30.85,16.4 33.25,18.8 U16.37
CH6N
  Top 0.3: U16.21 31.65,34.4 30.85,35.2 26.3,35.2 R12.2
CH6P
  Top 0.3: U16.22 30.85,34.2 30.45,34.6 26.45,34.6 25.7,33.85 R4.2 25.7,34.05
CH6V
  Top 0.3: R43.2 R44.2 20.85,15 23.45,17.6 30.05,17.6 32.45,20 U16.36
CH7V  (via drill 0.6)
  Top 0.3: R10.2 R9.2 | 16.05,15 16,15 R9.2 | R9.2 15.85,15 17.25,16.4 19.85,16.4 v20.25,16.8 | v31.45,27.2 U16.28
  Bottom 0.3: v20.25,16.8 20.45,17 30.45,17 31.65,18.2 31.65,27 v31.45,27.2
DGND  (via drill 0.6)
  Top 0.3: C11.2 C10.2 | 37.05,36.4 36.85,36.4 | 37.05,36.4 36.85,36.6 | 37.05,36.4 C18.2 36.45,35.8 36.45,35.4 | 29.16,53.1 U7.1 | U6.1 12.36,53.09 12.45,53 | U1.1 20.76,53.1 20.65,53 | U4.1 72.36,52.9 72.65,52.6 | 63.95,52.91 U3.1 | 63.65,52.6 63.95,52.91 | 63.95,52.91 65.94,52.91 C6.2 | U5.1 80.75,52.9 81.05,52.6
  Top 0.5: 28.45,20 27.65,20 27.45,20.2 | 28.45,20 31.25,20 31.65,20.4 U16.35 31.65,22.4 33.05,23.8 v33.45,23.8 | C19.2 28.45,20 | 36.45,26 U16.15
  Top 0.6: 37.65,37.4 38.65,37.4 38.65,41 43.25,41 43.25,44.4 35.05,44.4 35.05,39.8
  Top 0.7: 10.45,53 11.65,53 | 19.05,53 20.25,53 | 27.25,53 28.65,53 | 61.05,52.6 62.25,52.6 | 70.45,52.6 71.65,52.6 | 78.85,52.6 80.05,52.6
  Top 1: C5.2 74.65,58.45 D4.A | C6.2 66.25,58.45 D3.A | C7.2 57.85,58.45 D2.A | C2.2 23.05,58.45 D7.A | C3.2 14.65,58.45 D6.A | D5.A 6.25,58.45 C4.2 10.45,53 | 39.85,47.6 39.85,56.2 41.8,56.2 | 48.45,47.6 48.45,56.2 50.3,56.2 U14.3 | 41.8,56.2 41.85,56.2 | 41.8,56.2 U13.3 | 31.25,53 31.25,47.6 | 31.25,53 31.25,56.2 33.05,56.2 33.1,56.25 U12.3 | 11.65,53 12.45,53 C3.2 | 31.25,53 28.65,53 28.45,53 | C3.2 19.05,53 | 20.25,53 20.65,53 C2.2 | C2.2 27.25,53 | 57.25,52.6 61.05,52.6 | 62.25,52.6 63.65,52.6 C6.2 | C6.2 70.45,52.6 | 71.65,52.6 72.65,52.6 C5.2 | C5.2 78.85,52.6 | 80.05,52.6 81.05,52.6 82.85,52.6 82.85,56.2 82.9,56.25 U9.3 | 100.05,47.6 100.05,56.2 100.1,56.25 U11.3 | U10.3 91.5,56.25 91.45,56.2
  Top 3: 39.85,47.6 48.45,47.6
  Bottom 0.45: 33.05,23.4 33.05,31.4
  Bottom 0.5: 39.05,28.6 39.05,29 | 33.05,23 37.45,23 | 33.05,23 32.85,23 | 33.05,23 33.05,23.4 v33.45,23.8 | 39.05,24.6 39.05,28.6 | 39.05,28.6 39.45,28.6 39.45,28.2
  other vias: 9.45,44.2 6.45,44.2 23.05,54.8 6.45,55 6.45,60.8 22.85,45.8 57.05,60.8 6.45,64.8 55.65,50.2 31.45,55.2 48.85,67 48.85,63.6 53.45,67 53.45,63.6 94.45,67 99.25,67 94.45,64.8 99.25,63.6 106.05,64.8 106.05,61.4 100.25,55.2 106.25,48.2 91.65,55.2 87.45,41.8 95.25,43.4 96.25,45.2 83.25,38 74.45,45.6 75.85,45.6 74.65,54.2 83.05,55.2 40.05,55.2 48.65,55.2 6.45,7.2 106.05,7.2 74.45,5 54.65,42 57.85,41.2 36.05,30.6 36.05,26.2 54.85,28.4
  pour Top (rank 2): 5.05,4 107.45,4 107.45,69.2 4.85,69.2
  pour Bottom (rank 2): 5.05,4 107.45,4 107.45,69.2 4.85,69.2
IO1N
  Top 1: J1.2 46.09,62.16 46.45,61.8 51.5,61.8 D14.A 52.65,56.55 U14.2 U14.4
IO1P
  Top 0.6: U7.3 26.61,57.91 D7.K
  Top 1: J1.5 30.85,62.15 D7.K
IO2N
  Top 1: J1.3 41.01,62.24 42.25,61 43.7,61 D12.A 44.05,56.55 U13.2 U13.4
IO2P
  Top 0.6: U1.3 18.21,57.91 D6.K
  Top 1: J1.6 25.77,62.52 24.25,61 22.25,61 19.85,58.6 D6.K
IO3N
  Top 1: J1.4 35.93,60.17 D13.A 35.45,56.55 U12.2 U12.4
IO3P
  Top 0.6: U6.3 9.81,57.91 10.88,58.98
  Top 1: J1.7 20.69,62.44 19.25,61 12.9,61 10.88,58.98 D5.K
IO4N
  Top 1: U11.4 U11.2 104.25,56.55 D11.A 103.1,61.8 96.25,61.8 94.85,63.2 92.65,63.2 91.81,64.04 J2.2
IO4P
  Top 0.6: U5.3 78.22,57.91 D4.K
  Top 1: J2.5 76.57,60.93 D4.K
IO5N
  Top 1: J2.3 86.73,62.92 87.85,61.8 94.25,61.8 97.45,58.6 D10.A | D10.A 97.5,58.6 | D10.A 95.65,56.55 U10.2 U10.4
IO5P
  Top 0.6: U4.3 69.81,57.91 D3.K
  Top 1: J2.6 71.49,59.59 D3.K
IO5V
  Top 0.3: J3.3 25.77,13.07 R42.1
IO6N
  Top 1: J2.4 81.65,62.6 82.45,61.8 85.9,61.8 D9.A 87.05,56.55 U9.2 U9.4
IO6P
  Top 0.6: U3.3 61.41,57.91 D2.K
  Top 1: J2.7 66.41,62.16 65.25,61 64.5,61 D2.K
IO6V
  Top 0.3: J3.2 20.69,12.99 R44.1
LG
  Top 0.3: U16.33 26.3,23.2 R50.2
LR  (via drill 0.6)
  Top 0.3: v38.25,23.8 38.85,23.2 U16.1 | v40.65,37.2 42,37.2 R49.2
  Bottom 0.3: v38.25,23.8 38.25,34.8 v40.65,37.2
MISO
  Top 0.3: U16.11 41.25,31.2 43.05,33 46.6,33 R19.2
MOSI
  Top 0.3: U16.10 41.65,30.4 42.65,31.4 43.2,31.4 R20.2
N$1
  Top 0.5: U16.6 42.65,27.2 43.25,27.8 51.25,27.8 C22.+
N$2
  Top 0.3: U16.16 35.65,34.8 35.45,35 35.45,37 36.92,38.48 C10.1 | 40.45,42.6 Y1.1 37.05,42.6 37.05,38.73 C10.1 | C10.1 36.65,38.6
N$3  (via drill 0.6)
  Top 0.3: v16.85,26 R7.1 | U1.2 19.48,54.4 v19.69,54.2
  Bottom 0.3: v19.69,54.2 19.69,41.84 17.25,39.4 17.25,26.4 v16.85,26
N$4  (via drill 0.6)
  Top 0.3: v46.25,54.2 46.25,56.15 U13.1 | v19.45,27 R16.1
  Bottom 0.3: v46.25,54.2 38.85,46.8 27.65,46.8 19.85,39 19.85,27.4 v19.45,27
N$5  (via drill 0.6)
  Top 0.3: v19.45,24.8 R17.1 | v54.85,54.2 54.85,56.15 U14.1
  Bottom 0.3: v19.45,24.8 20.45,25.8 20.45,38.6 28.05,46.2 46.85,46.2 v54.85,54.2
N$6  (via drill 0.6)
  Top 0.3: v27.89,54.2 U7.2 | v17.85,23.8 R8.1
  Bottom 0.3: v27.89,54.2 27.89,49.03 17.85,39 v17.85,23.8
N$7
  Top 0.5: U16.4 44,25.6 R29.1
N$8
  Top 0.5: U16.7 42.25,28 42.85,28.6 53.05,28.6 54.25,27.4 54.25,21.2 56.65,18.8 62.45,18.8 C21.+ 64.45,16.8 64.85,16.8 66.1,15.55 D17.2 66.1,9.94 J4.1
N$9  (via drill 0.6)
  Top 0.3: R27.2 64,38.35 63.85,38.2 63.85,36.4 | R22.2 81.4,20.2 81.45,20.2
  Top 0.6: C34.1 64.75,34.7 U17.2 66.95,34.7 | R28.2 60.1,35.4 62.25,35.4 62.25,36.4 | C34.1 64.45,34.8 | 62.25,36.4 D19.K | v79.25,25 79.25,22.6 | C34.1 v64.65,36.4 63.85,36.4 62.25,36.4 | 79.25,22.6 C16.+ | 81.45,20.2 84.49,17.16 L1.3 | 79.25,22.6 79.65,22.2 79.65,21.6 80.7,20.55 R22.2 | R3.1 78.7,43.95 79.45,43.2 v79.45,42.2
  Bottom 0.6: 70.55,33.7 67.85,36.4 v64.65,36.4 | 70.55,33.7 v79.25,25 | v79.45,42.2 70.95,33.7 70.55,33.7
N$10
  Top 0.3: D20.2 58.2,15.35 58.05,15.2
  Top 0.5: R29.2 45.7,25.6 47.65,25.6 58.05,15.2 62.25,11 62.25,8.09 J4.3
N$11
  Top 0.5: U16.3 44,24.8 R30.1
N$12
  Top 0.5: U16.42 37.25,19 C15.1
N$13  (via drill 0.6)
  Top 0.3: D18.2 56.85,14.6 57.15,14.9
  Top 0.5: R30.2 45.7,24.8 47.25,24.8 56.85,15.2 | 56.85,15.2 57.15,14.9 58.15,13.9 v58.15,13.5 | 56.85,14.6 56.85,15.2
  Bottom 0.5: J4.2 61.75,9.9 v58.15,13.5
N$14
  Top 0.3: U16.17 34.85,35.2 32.45,37.6 32.45,38.2 32.05,38.6 C11.1 31.85,38.73 31.85,42.6 Y1.2
N$15  (via drill 0.6)
  Top 0.3: v52.85,32.2 50.05,29.4 45.9,29.4 R18.1
  Bottom 0.3: 89.41,11.6 80.65,11.6 59.65,32.6 53.25,32.6 v52.85,32.2 | 89.41,11.6 89.45,11.6 | 89.41,11.6 J5.3
N$16  (via drill 0.6)
  Top 0.3: R19.1 48.45,32.8 48.85,33.2 53.45,33.2 54.85,31.8 v54.85,30.4
  Bottom 0.3: J5.9 80.05,9.2 58.45,30.8 55.25,30.8 v54.85,30.4
N$17  (via drill 0.6)
  Top 0.3: v50.25,34.2 49.25,35.2 42.25,35.2 41.9,34.85 R23.1
  Bottom 0.3: J5.5 89.25,9.2 87.45,11 80.25,11 59.25,32 54.05,32 53.25,31.2 50.65,31.2 50.25,31.6 v50.25,34.2
N$18  (via drill 0.6)
  Top 0.3: R22.1 v81.05,23.6 R24.2 | v89.95,33.1 91.95,35.1 U15.4
  Bottom 0.3: v81.05,23.6 83.65,23.6 87.65,27.6 87.65,30.8 v89.95,33.1
N$19  (via drill 0.6)
  Top 0.3: v49.85,30.6 48.45,30.6 48.5,30.55 R21.1
  Bottom 0.3: J5.7 86.73,9.32 85.65,10.4 79.85,10.4 58.85,31.4 54.45,31.4 53.65,30.6 v49.85,30.6
N$20  (via drill 0.6)
  Top 0.3: 45.5,31.85 R20.1 45.85,32 45.85,31.8 50.85,31.8 v51.25,32.2
  Bottom 0.3: J5.1 94.35,9.3 91.45,12.2 81.05,12.2 60.05,33.2 52.25,33.2 v51.25,32.2
N$21
  Top 0.6: R1.1 C9.1 100.85,7.6 99.85,6.6 94.41,6.6 J5.2
N$22  (via drill 0.6)
  Top 0.6: U15.2 92.56,38.4 90.65,38.4 90.05,37.8 D16.K 89.05,37.15 v89.05,36
  Bottom 0.6: L1.1 95.89,36 v89.05,36
N$23
  Top 0.3: R32.2 R31.1 63.7,29.6 U17.5
N$24
  Top 0.3: R27.1 65.7,38.35 65.85,38.2 67.2,38.2 R26.2 U17.1 67.25,36.61
N$25  (via drill 0.6)
  Top 0.3: v16.05,28.2 R2.1 | U6.2 11.09,54.23 v11.05,54.2
  Bottom 0.3: v11.05,54.2 11.05,33.2 v16.05,28.2
N$26  (via drill 0.6)
  Top 0.3: v18.85,29.2 R15.1 | v37.65,54.2 37.65,56.15 U12.1
  Bottom 0.3: v37.65,54.2 34.05,54.2 18.85,39 v18.85,29.2
N$27  (via drill 0.6)
  Top 0.3: R6.1 28.85,37.65 v28.85,39 | v79.45,53.8 79.45,55.77 U5.2
  Bottom 0.3: v28.85,39 34.25,44.4 76.05,44.4 76.85,45.2 76.85,51.2 v79.45,53.8
N$28  (via drill 0.6)
  Top 0.3: 106.45,56.25 U11.1 106.55,55.1 v105.65,54.2 | R14.1 v48.85,34.2
  Bottom 0.3: v48.85,34.2 57.25,42.6 77.25,42.6 78.65,44 78.65,50 80.25,51.6 103.05,51.6 v105.65,54.2
N$29  (via drill 0.6)
  Top 0.3: U4.2 71.08,53.8 v71.05,53.8 | v25.45,39.6 26.9,39.6 R5.1
  Bottom 0.3: v71.05,53.8 71.05,47 69.05,45 30.85,45 v25.45,39.6
N$30  (via drill 0.6)
  Top 0.3: v22.25,38 R13.1 | v97.85,54.2 97.85,56.25 U10.1
  Bottom 0.3: v22.25,38 21.65,37.4 21.65,35.2 22.25,34.6 27.45,34.6 36.05,43.2 76.85,43.2 78.05,44.4 78.05,50.4 79.85,52.2 95.85,52.2 v97.85,54.2
N$31  (via drill 0.6)
  Top 0.3: v21.45,33.6 R4.1 | v61.65,53.8 62.05,53.8 62.69,54.44 U3.2
  Bottom 0.3: v21.45,33.6 21.05,34 21.05,38.2 28.45,45.6 53.45,45.6 v61.65,53.8
N$32  (via drill 0.6)
  Top 0.3: R12.1 v22.65,35.8 | v89.25,54.2 89.25,56.25 U9.1
  Bottom 0.3: v22.65,35.8 27.65,35.8 35.65,43.8 76.45,43.8 77.45,44.8 77.45,50.8 79.45,52.8 87.85,52.8 v89.25,54.2
N$33
  Top 0.5: L3.2 27.25,31.4 | 27.25,31.4 27.25,31.2 28.05,30.4 U16.24 | 27.25,31.4 C17.1
N$34
  Top 0.3: J3.1 15.61,12.91 R9.1
N$35
  Bottom 0.5: 0,0 0,72 112.5,72 112.5,0 0,0
N$36
  Top 0.5: 0,0 0,72 112.5,72 112.5,0 0,0
N$37
  Top 0.3: D1.3 56.95,34.9 58.05,36 58.05,38.2 57.65,38.6 54.3,38.6 R25.1
N$38
  Top 0.3: Q2.6 49.2,39.25 49.45,39 51.05,39 52,39.95 R11.2
N$39
  Top 0.3: R25.2 51.8,37.8 50.65,37.8 50.5,37.95 Q2.3
N$40
  Top 0.3: 55.55,35.1 D1.4 55.55,34.1 56.25,33.4 57.65,33.4 58.65,34.4 58.65,38.6 57.45,39.8 54.1,39.8 R11.1
N$41
  Top 0.3: 42.3,38.85 42.25,38.8 | 42.3,38.85 R45.2 46.3,36.8 49.25,36.8 49.85,37.4 Q2.2 | R49.1 42.3,38.85
N$43  (via drill 0.6)
  Top 0.3: v21.45,22.4 23.8,22.4 R50.1 | Q2.5 49.85,40.4 49.65,40.6 48.65,40.6 v48.05,40 47.2,39.15 R46.1
  Bottom 0.3: v21.45,22.4 21.45,31 24.45,34 27.85,34 36.45,42.6 45.45,42.6 v48.05,40
N$45
  Top 0.3: 10.25,26 10.25,22 5.25,22 5.25,26 | 5.25,26 10.25,26 | 5.25,26 5.25,30 10.25,30 10.25,26
N$46
  Bottom 0.3: 10.25,26 10.25,30 5.25,30 5.25,26 | 10.25,26 10.25,22 5.25,22 5.25,26 | 5.25,26 10.25,26
N$47
  Top 0.3: J3.4 R40.1
N$48
  Top 0.3: J3.5 35.93,13.07 R38.1
N$49
  Top 0.3: J3.6 41.01,12.99 R36.1
N$50
  Top 0.3: J3.7 46.09,12.91 R34.1
N$52
  Bottom 0.3: 86.25,23 105.25,23 105.25,19 86.25,19 86.25,23
SCK
  Top 0.3: U16.9 41.85,29.6 43.05,30.8 46.6,30.8 R21.2
UGND  (via drill 0.6)
  Top 0.5: U16.5 43.05,26.4 43.45,26.8 50.85,26.8
  Bottom 0.5: 39.45,26.4 39.45,24.2 | 39.45,26.4 39.45,27.8 | 39.45,26.4 49.05,26.4 v49.05,26.2
  other vias: 57.45,12.2 69.65,15.4 58.25,17.2 61.05,9 63.45,11.8 47.65,22.4
  pour Bottom: 39.65,28 42.25,28 42.85,28.6 53.05,28.6 54.25,27.4 54.25,21.2 56.65,18.8 62.85,18.8 65.65,16 70.05,16 73.25,12.8 73.25,4 56.05,4 56.05,15 49.25,21.8 43.05,21.8 41.85,23 41.85,24 39.65,24
  pour Top: 39.65,28 42.25,28 42.85,28.6 53.05,28.6 54.25,27.4 54.25,21.4 56.65,18.8 62.85,18.8 65.65,16 70.05,16 73.25,12.8 73.25,4 56.05,4 56.05,15 49.25,21.8 43.05,21.8 41.85,23 41.85,24 39.65,24
VAV  (via drill 0.6)
  Top 0.3: v31.45,29.2 31.05,29.6 U16.25 | 14,18.4 v18.65,18.4 | 14,18.4 R48.2 | 14,18.4 14,17.7 R47.2
  Bottom 0.3: v18.65,18.4 21.05,18.4 21.25,18.2 29.65,18.2 30.45,19 30.45,28.2 v31.45,29.2

### Text on the board
Top: 1
Bottom: 2 | ATZ PCB1.1
silk: ATZ PCB1.1